# EasyEDA Pro project mainPCB.eprj

# Schematic mainPCB
Board Name: mainPCB; Create Date: 2025-12-13; Page Name: mainPCB; Project Name: mainPCB; Schematic Name: mainPCB; Update Date: 2025-12-13; File: mainPCB; Id: /; Sheet: /
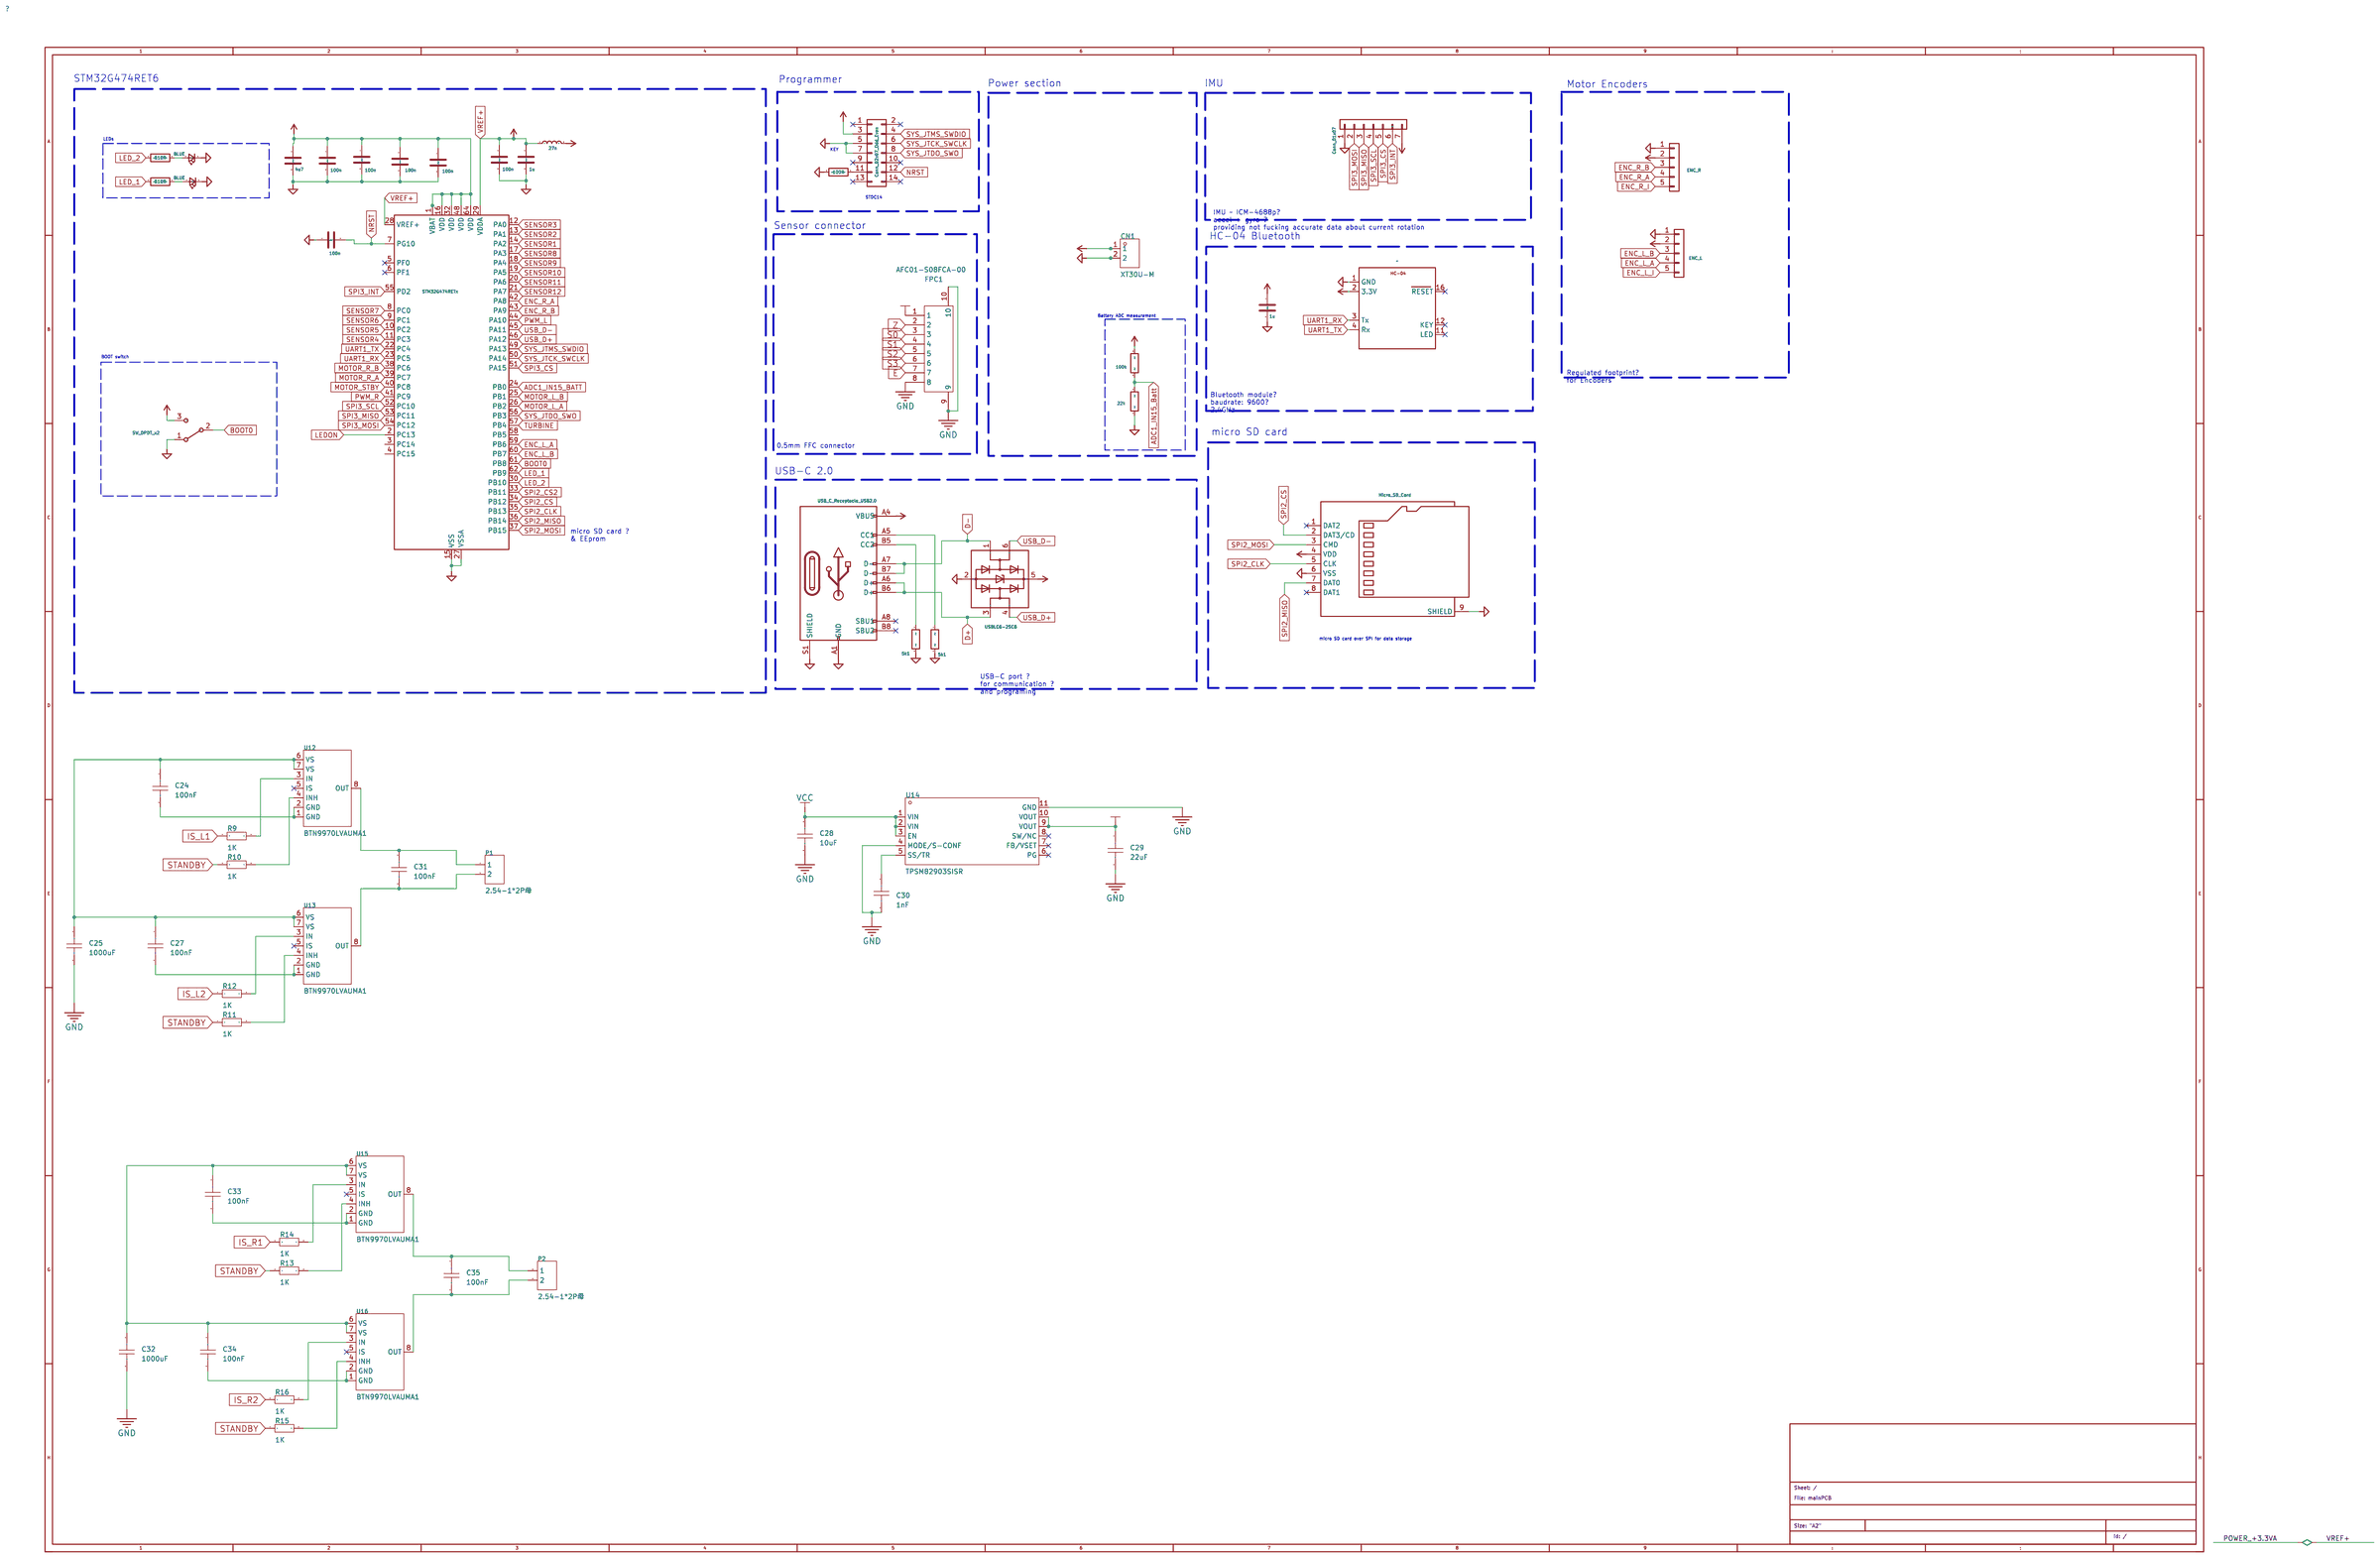
[diagram p0: schematic sheet]

## Parts
C6  4u7
C7  100n
C8  100n
C9  100n
C10  100n
C11  100n
C15  100n
C16  1u
C22  1u
C24  100nF  [C0603]
C25  1000uF  [C0603]
C27  100nF  [C0603]
C28  10uF  [C0603]
C29  22uF  [C0603]
C30  1nF  [C0603]
C31  100nF  [C0603]
C32  1000uF  [C0603]
C33  100nF  [C0603]
C34  100nF  [C0603]
C35  100nF  [C0603]
CN1  XT30U-M  [CONN-TH_XT30U-M]
D1  BLUE
D2  BLUE
FPC1  AFC01-S08FCA-00  [FPC-SMD_P0.50-8P_FGS-XJ-H2.0]
IMU1  Conn_01x07
J1  USB_C_Receptacle_USB2.0
J4  Micro_SD_Card
J5  ENC_L
J6  ENC_R
L1  27n
P1  2.54-1*2P母  [HDR-TH_2P-P2.54-V-F]
P2  2.54-1*2P母  [HDR-TH_2P-P2.54-V-F]
PROG1  Conn_02x07_Odd_Even
R1  510R
R2  510R
R3  100R
R4  5k1
R5  5k1
R6  100k
R7  22k
R9  1K  [R0603]
R10  1K  [R0603]
R11  1K  [R0603]
R12  1K  [R0603]
R13  1K  [R0603]
R14  1K  [R0603]
R15  1K  [R0603]
R16  1K  [R0603]
SW1  SW_DPDT_x2  (section 1)
U2  STM32G474RETx
U4  USBLC6-2SC6
U8  -
U12  BTN9970LVAUMA1  [HSOF-7_L6.9-W6.7-P0.90-LS8.0-BL]
U13  BTN9970LVAUMA1  [HSOF-7_L6.9-W6.7-P0.90-LS8.0-BL]
U14  TPSM82903SISR  [USIP-11_L3.0-W2.8_TPSM82901SISR]
U15  BTN9970LVAUMA1  [HSOF-7_L6.9-W6.7-P0.90-LS8.0-BL]
U16  BTN9970LVAUMA1  [HSOF-7_L6.9-W6.7-P0.90-LS8.0-BL]

## Library data of the parts
C6-C11 C15 C16 C22 = Device_C
C24 C25 C27-C35 = CAP_0603: Supplier Footprint: 0603
CN1 = XT30U-M: LCSC Part Name: AMASS(艾迈斯)轻量版锂电池插头公头 XT30U-M; Supplier Part: C99101; Manufacturer: AMASS(艾迈斯); JLCPCB Part Class: Extended Part; Datasheet: https://item.szlcsc.com/datasheet/XT30U-M/100314.html; Supplier: LCSC; Type: Plug; Colour: Yellow; InterfaceType: Male
D1 D2 = Device_LED_Small: LCSC Part #: C72041
FPC1 = AFC01-S08FCA-00: LCSC Part Name: 间距:0.5mm P数:8P 翻盖式 下接; Supplier Part: C262657; Manufacturer: JS(钜硕电子); Supplier Footprint: SMD,P=0.5mm,卧贴; JLCPCB Part Class: Extended Part; Datasheet: https://item.szlcsc.com/datasheet/AFC01-S08FCA-00/253916.html; Supplier: LCSC; Locking Feature: Hinged Lid; Contact Type: Bottom Contact; Number of Contacts: 8P; Pitch: 0.5mm; Mounting Type: Surface Mount, Right Angle; FFC, FCB Thickness: 0.3mm; Height Above Board: 2mm
IMU1 = Connector_Generic_Conn_01x07
J1 = Connector_USB_C_Receptacle_USB2.0: User doc link: https://www.usb.org/sites/default/files/documents/usb_type-c.zip
J4 = Connector_Micro_SD_Card: User doc link: http://katalog.we-online.de/em/datasheet/693072010801.pdf
J5 J6 = Connector_Generic_Conn_01x05: Generic connector, single row, 01x05, script generated (kicad-library-utils/schlib/autogen/connector/)
L1 = Device_L
P1 P2 = 2.54-1*2P母: LCSC Part Name: 1x2P 间距:2.54mm 直插; Supplier Part: C49661; Manufacturer: BOOMELE(博穆精密); Supplier Footprint: 插件,P=2.54mm; JLCPCB Part Class: Extended Part; Datasheet: https://item.szlcsc.com/datasheet/2.54-1*2P%25E6%25AF%258D/50669.html; Supplier: LCSC; Holes Structure: 1x2P; Pitch: 2.54mm; Circular Hole / Square Hole: Square Hole; Mounting Type: Through Hole; Number of Rows: 1; Number of Positions: 2P; Current Rating: 3A; Holes Direction: Top; Contact Material: Brass; Operating Temperature: -40℃~+105℃; PIN Length: 3.3mm
PROG1 = Connector_Generic_Conn_02x07_Odd_Even
R1-R7 = Device_R
R9-R16 = Res_0603: Supplier Footprint: 0603
SW1 = Switch_SW_DPDT_x2
U2 = MCU_ST_STM32G4_STM32G474RETx: User doc link: https://www.st.com/resource/en/datasheet/stm32g474re.pdf
U4 = Power_Protection_USBLC6-2SC6: User doc link: https://www.st.com/resource/en/datasheet/usblc6-2.pdf
U8 = HC-04_HC-04
U12 U13 U15 U16 = BTN9970LVAUMA1: LCSC Part Name: 带集成驱动器的大电流PN半桥; Supplier Part: C3655537; Manufacturer: Infineon(英飞凌); Supplier Footprint: HSOF-7; JLCPCB Part Class: Extended Part; Datasheet: https://item.szlcsc.com/datasheet/BTN9970LVAUMA1/4223334.html; Supplier: LCSC
U14 = TPSM82903SISR: LCSC Part Name: 3A, 3V至17V高效低IQ降压转换器模块; Supplier Part: C6290583; Manufacturer: TI(德州仪器); Supplier Footprint: LDFN-10-EP(2.8x3); JLCPCB Part Class: Extended Part; Datasheet: https://item.szlcsc.com/datasheet/TPSM82903SISR/7237464.html; Supplier: LCSC; Function: Step-down type; Voltage - Supply: 3V~17V; Output Current: 3A; Frequency - Switching: 2.5MHz; Operating Temperature: -40℃~+125℃@(TJ); Synchronous Rectifier: Yes; Number of Outputs: 1; Topology: Step-down; Switch tube (built-in/external): Built-in

## Nets
+3.3V: C29.1 FPC1.1 U14.9(VOUT) U14.10(VOUT)
GND: C25.2 C28.2 C29.2 C30.2 C32.2 FPC1.8 FPC1.9 FPC1.10 U14.4(MODE/S-CONF) U14.11(GND)
VCC: C28.1 U14.1(VIN) U14.2(VIN) U14.3(EN)
ADC1_IN15_BATT: U2.24(PB0)
ADC1_IN15_Batt: R6.1 R7.2
BOOT0: SW1.2(B) U2.61(PB8)
D+: J1.A6(D+) J1.B6(D+) U4.3(I/O2)
D-: J1.A7(D-) J1.B7(D-) U4.1(I/O1)
E: FPC1.7
ENC_L_A: J5.4(Pin) U2.59(PB6)
ENC_L_B: J5.3(Pin) U2.60(PB7)
ENC_L_I: J5.5(Pin)
ENC_R_A: J6.4(Pin) U2.42(PA8)
ENC_R_B: J6.3(Pin) U2.43(PA9)
ENC_R_I: J6.5(Pin)
IS_L1: R9.1
IS_L2: R12.1
IS_R1: R14.1
IS_R2: R16.1
LED_1: R2.2 U2.62(PB9)
LED_2: R1.2 U2.30(PB10)
LEDON: U2.2(PC13)
MOTOR_L_A: U2.26(PB2)
MOTOR_L_B: U2.25(PB1)
MOTOR_R_A: U2.39(PC7)
MOTOR_R_B: U2.38(PC6)
MOTOR_STBY: U2.40(PC8)
NRST: C8.2 PROG1.12(Pin) U2.7(PG10)
POWER_+3.3V: J5.2(Pin) J6.2(Pin)
POWER_+3.3VA: C15.1 C16.1 L1.1 U2.28(VREF+) U2.29(VDDA)
POWER_+3V3: C6.1 C7.1 C9.1 C10.1 C11.1 C22.1 IMU1.7(Pin) J4.4(VDD) L1.2 PROG1.3(Pin) SW1.3(C) U2.1(VBAT) U2.16(VDD) U2.32(VDD) U2.48(VDD) U2.64(VDD) U8.2(3.3V)
POWER_+5V: J1.A4(VBUS) J1.A9(VBUS) J1.B4(VBUS) J1.B9(VBUS) U4.5(VBUS)
POWER_GND: C6.2 C7.2 C8.1 C9.2 C10.2 C11.2 C15.2 C16.2 C22.2 CN1.2 D1.1(K) D2.1(K) IMU1.1(Pin) J1.A1(GND) J1.A12(GND) J1.B1(GND) J1.B12(GND) J1.S1(SHIELD) J4.6(VSS) J4.9(SHIELD) J5.1(Pin) J6.1(Pin) PROG1.5(Pin) PROG1.7(Pin) R3.1 R4.2 R5.2 R7.1 SW1.1(A) U2.15(VSS) U2.27(VSSA) U2.31(VSS) U2.47(VSS) U2.63(VSS) U4.2(GND) U8.1(GND)
POWER_VDC: CN1.1 R6.2
PWM_L: U2.44(PA10)
PWM_R: U2.41(PC9)
S0: FPC1.3
S1: FPC1.4
S2: FPC1.5
S3: FPC1.6
SENSOR1: U2.14(PA2)
SENSOR2: U2.13(PA1)
SENSOR3: U2.12(PA0)
SENSOR4: U2.11(PC3)
SENSOR5: U2.10(PC2)
SENSOR6: U2.9(PC1)
SENSOR7: U2.8(PC0)
SENSOR8: U2.17(PA3)
SENSOR9: U2.18(PA4)
SENSOR10: U2.19(PA5)
SENSOR11: U2.20(PA6)
SENSOR12: U2.21(PA7)
SPI2_CLK: J4.5(CLK) U2.35(PB13)
SPI2_CS: J4.2(DAT3/CD) U2.34(PB12)
SPI2_CS2: U2.33(PB11)
SPI2_MISO: J4.7(DAT0) U2.36(PB14)
SPI2_MOSI: J4.3(CMD) U2.37(PB15)
SPI3_CS: IMU1.5(Pin) U2.51(PA15)
SPI3_INT: IMU1.6(Pin) U2.55(PD2)
SPI3_MISO: IMU1.3(Pin) U2.53(PC11)
SPI3_MOSI: IMU1.2(Pin) U2.54(PC12)
SPI3_SCL: IMU1.4(Pin) U2.52(PC10)
STANDBY: R10.1 R11.1 R13.1 R15.1
SYS_JTCK_SWCLK: PROG1.6(Pin) U2.50(PA14)
SYS_JTDO_SWO: PROG1.8(Pin) U2.56(PB3)
SYS_JTMS_SWDIO: PROG1.4(Pin) U2.49(PA13)
TURBINE: U2.57(PB4)
UART1_RX: U2.23(PC5) U8.3(Tx)
UART1_TX: U2.22(PC4) U8.4(Rx)
USB_D+: U2.46(PA12) U4.4(I/O2)
USB_D-: U2.45(PA11) U4.6(I/O1)
Z: FPC1.2
Net-(C24-1): C24.1 C25.1 C27.1 U12.6(VS) U12.7(VS) U13.6(VS) U13.7(VS)
Net-(C24-2): C24.2 U12.1(GND) U12.2(GND)
Net-(C27-2): C27.2 U13.1(GND) U13.2(GND)
Net-(C30-1): C30.1 U14.5(SS/TR)
Net-(C31-1): C31.1 P1.1 U12.8(OUT)
Net-(C31-2): C31.2 P1.2 U13.8(OUT)
Net-(C32-1): C32.1 C33.1 C34.1 U15.6(VS) U15.7(VS) U16.6(VS) U16.7(VS)
Net-(C33-2): C33.2 U15.1(GND) U15.2(GND)
Net-(C34-2): C34.2 U16.1(GND) U16.2(GND)
Net-(C35-1): C35.1 P2.1 U15.8(OUT)
Net-(C35-2): C35.2 P2.2 U16.8(OUT)
Net-(D1-2): D1.2(A) R1.1
Net-(D2-2): D2.2(A) R2.1
Net-(J1-A5): J1.A5(CC1) R5.1
Net-(J1-B5): J1.B5(CC2) R4.1
Net-(PROG1-11): PROG1.11(Pin) R3.2
Net-(R9-2): R9.2 U12.3(IN)
Net-(R10-2): R10.2 U12.4(INH)
Net-(R11-2): R11.2 U13.4(INH)
Net-(R12-2): R12.2 U13.3(IN)
Net-(R13-2): R13.2 U15.4(INH)
Net-(R14-2): R14.2 U15.3(IN)
Net-(R15-2): R15.2 U16.4(INH)
Net-(R16-2): R16.2 U16.3(IN)

Not connected (* = marked no-connect by the designer): J1 A8(SBU1)* B8(SBU2)*; J4 1(DAT2)* 8(DAT1)*; PROG1 1(Pin)* 2(Pin)* 9(Pin)* 10(Pin)* 13(Pin)* 14(Pin)*; U2 3(PC14) 4(PC15) 5(PF0)* 6(PF1)* 58(PB5); U8 11(LED)* 12(KEY)* 16(RESET)*; U12 5(IS)*; U13 5(IS)*; U14 6(PG)* 7(FB/VSET)* 8(SW/NC)*; U15 5(IS)*; U16 5(IS)*

## Notes on the sheet
- STM32G474RET6
- Programmer
- Power section
- IMU
- Motor Encoders
- LEDs
- KEY
- STDC14
- IMU ~ ICM-4688p
  accel + gyro
  providing not fucking accurate data about current rotation
- Sensor connector
- HC-04 Bluetooth
- Battery ADC measurement
- BOOT switch
- Regulated footprint
  for Encoders
- Bluetooth module
  baudrate: 9600
  2,4GHz
- micro SD card
- 0.5mm FFC connector
- USB-C 2.0
- micro SD card
  & EEprom
- micro SD card over SPI for data storage
- USB-C port
  for communication
  and programing
